# Altium schematic sheet STM32MP25XXAK Power_ascii.SchDoc: Power MPU
size A3; Date: Not used; ApprovedBy: Not used; CheckedBy: Not used; Author: Not used; CompanyName: STMicroelectronics; DrawnBy: Not used; Engineer: Not used; Organization: Not used; Address1: Not used; Address2: Not used; Address3: Not used; Address4: Not used; DocumentNumber: Not used; Revision: Not used; SheetNumber: 5; SheetTotal: 7; CurrentTime: Not used; CurrentDate: Not used; Time: Not used; DocumentFullPathAndName: Not used; DocumentName: Not used; ModifiedDate: Not used; ImagePath: Not used; ProjectName: Not used; Application_BuildNumber: Not used
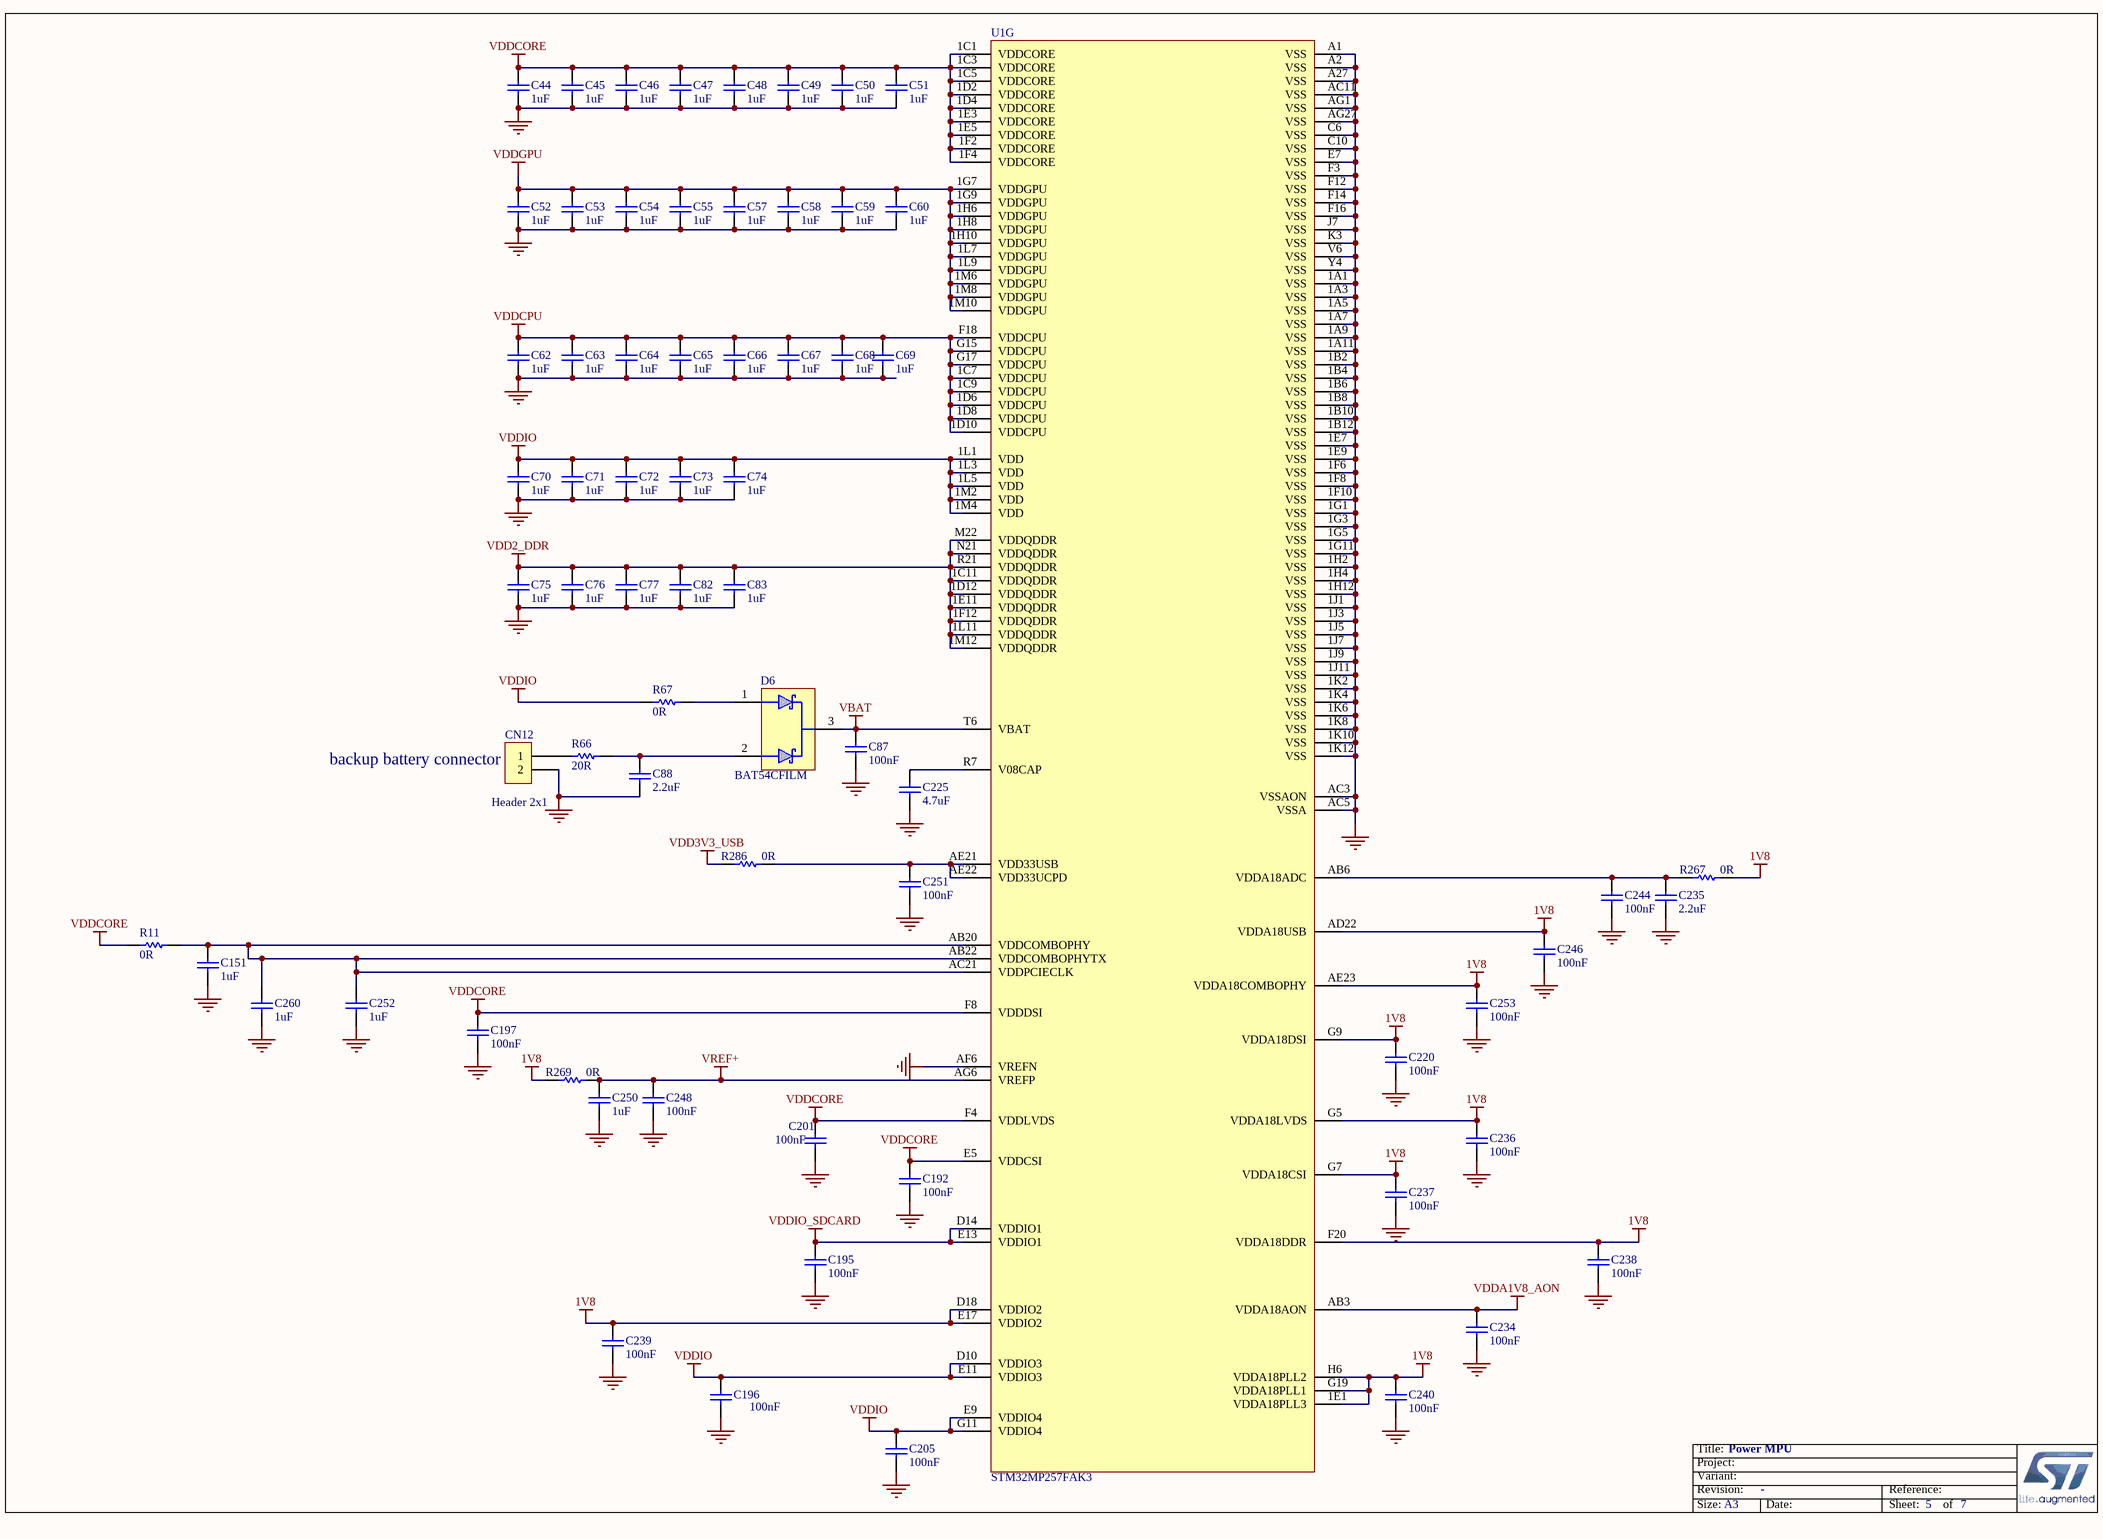
[diagram p0: STM32MP25XXAK Power_ascii.SchDoc]

## Parts
C44  1uF  [C0201_MURATA_GRM033_H0P3]
C45  1uF  [C0201_MURATA_GRM033_H0P3]
C46  1uF  [C0201_MURATA_GRM033_H0P3]
C47  1uF  [C0201_MURATA_GRM033_H0P3]
C48  1uF  [C0201_MURATA_GRM033_H0P3]
C49  1uF  [C0201_MURATA_GRM033_H0P3]
C50  1uF  [C0201_MURATA_GRM033_H0P3]
C51  1uF  [C0201_MURATA_GRM033_H0P3]
C52  1uF  [C0201_MURATA_GRM033_H0P3]
C53  1uF  [C0201_MURATA_GRM033_H0P3]
C54  1uF  [C0201_MURATA_GRM033_H0P3]
C55  1uF  [C0201_MURATA_GRM033_H0P3]
C57  1uF  [C0201_MURATA_GRM033_H0P3]
C58  1uF  [C0201_MURATA_GRM033_H0P3]
C59  1uF  [C0201_MURATA_GRM033_H0P3]
C60  1uF  [C0201_MURATA_GRM033_H0P3]
C62  1uF  [C0201_MURATA_GRM033_H0P3]
C63  1uF  [C0201_MURATA_GRM033_H0P3]
C64  1uF  [C0201_MURATA_GRM033_H0P3]
C65  1uF  [C0201_MURATA_GRM033_H0P3]
C66  1uF  [C0201_MURATA_GRM033_H0P3]
C67  1uF  [C0201_MURATA_GRM033_H0P3]
C68  1uF  [C0201_MURATA_GRM033_H0P3]
C69  1uF  [C0201_MURATA_GRM033_H0P3]
C70  1uF  [C0201_MURATA_GRM033_H0P3]
C71  1uF  [C0201_MURATA_GRM033_H0P3]
C72  1uF  [C0201_MURATA_GRM033_H0P3]
C73  1uF  [C0201_MURATA_GRM033_H0P3]
C74  1uF  [C0201_MURATA_GRM033_H0P3]
C75  1uF  [C0201_MURATA_GRM033_H0P3]
C76  1uF  [C0201_MURATA_GRM033_H0P3]
C77  1uF  [C0201_MURATA_GRM033_H0P3]
C82  1uF  [C0201_MURATA_GRM033_H0P3]
C83  1uF  [C0201_MURATA_GRM033_H0P3]
C87  value 100nF  [C0402]
C88  value 2.2uF  [C0402]  (hidden comment: Capacitor)
C151  value 1uF  [C0201_MURATA_GRM033_H0P3]  (hidden comment: Capacitor)
C192  value 100nF  [C0201_MURATA_GRM033_H0P3]  (hidden comment: Capacitor)
C195  value 100nF  [C0201_MURATA_GRM033_H0P3]  (hidden comment: Capacitor)
C196  value 100nF  [C0201_MURATA_GRM033_H0P3]  (hidden comment: Capacitor)
C197  value 100nF  [C0201_MURATA_GRM033_H0P3]  (hidden comment: Capacitor)
C201  value 100nF  [C0201_MURATA_GRM033_H0P3]  (hidden comment: Capacitor)
C205  value 100nF  [C0201_MURATA_GRM033_H0P3]  (hidden comment: Capacitor)
C220  value 100nF  [C0201_MURATA_GRM033_H0P3]  (hidden comment: Capacitor)
C225  value 4.7uF  [C0201_H0P5]  (hidden comment: Capacitor)
C234  value 100nF  [C0201_MURATA_GRM033_H0P3]  (hidden comment: Capacitor)
C235  value 2.2uF  [C0201_H0P5]  (hidden comment: Capacitor)
C236  value 100nF  [C0201_MURATA_GRM033_H0P3]  (hidden comment: Capacitor)
C237  value 100nF  [C0201_MURATA_GRM033_H0P3]  (hidden comment: Capacitor)
C238  value 100nF  [C0201_MURATA_GRM033_H0P3]  (hidden comment: Capacitor)
C239  value 100nF  [C0201_MURATA_GRM033_H0P3]  (hidden comment: Capacitor)
C240  value 100nF  [C0201_MURATA_GRM033_H0P3]  (hidden comment: Capacitor)
C244  value 100nF  [C0201_MURATA_GRM033_H0P3]  (hidden comment: Capacitor)
C246  value 100nF  [C0201_MURATA_GRM033_H0P3]  (hidden comment: Capacitor)
C248  value 100nF  [C0201_MURATA_GRM033_H0P3]  (hidden comment: Capacitor)
C250  value 1uF  [C0201_MURATA_GRM033_H0P3]  (hidden comment: Capacitor)
C251  value 100nF  [C0201_MURATA_GRM033_H0P3]  (hidden comment: Capacitor)
C252  value 1uF  [C0201_MURATA_GRM033_H0P3]  (hidden comment: Capacitor)
C253  value 100nF  [C0201_MURATA_GRM033_H0P3]  (hidden comment: Capacitor)
C260  value 1uF  [C0201_MURATA_GRM033_H0P3]  (hidden comment: Capacitor)
CN12  value Header 2x1  [CON_MOLEX_53047-0210]
D6  value BAT54CFILM  [DIO_SOT23]  (hidden comment: DIODE_3P_DUAL_COMMON_CATHODE)
R11  value 0R  [R0603]  (hidden comment: Resistor)
R66  value 20R  [R0402]  (hidden comment: Resistor)
R67  value 0R  [R0402]  (hidden comment: Resistor)
R267  value 0R  [R0402]
R269  value 0R  [R0402]
R286  value 0R  [R0402]
U1  STM32MP257FAK3  [ICC_TFBGA424_14X14_P050_H1P20_CODE-B0A2]  (part G of 9)

## Nets
1V8: C220.2 C236.2 C237.2 C238.2 C239.2 C240.2 C246.2 C253.2 R267.2 R269.1 U1.1E1(VDDA18PLL3) U1.AD22(VDDA18USB) U1.AE23(VDDA18COMBOPHY) U1.D18(VDDIO2) U1.E17(VDDIO2) U1.F20(VDDA18DDR) U1.G5(VDDA18LVDS) U1.G7(VDDA18CSI) U1.G9(VDDA18DSI) U1.G19(VDDA18PLL1) U1.H6(VDDA18PLL2)
GND: C44.2 C45.1 C46.1 C47.2 C48.1 C49.1 C50.1 C51.1 C52.1 C53.1 C54.1 C55.1 C57.1 C58.1 C59.1 C60.1 C62.2 C63.1 C64.1 C65.2 C66.1 C67.1 C68.1 C69.1 C70.2 C71.1 C72.1 C73.2 C74.1 C75.1 C76.1 C77.2 C82.1 C83.1 C87.1 C88.1 C151.1 C192.1 C195.1 C196.1 C197.1 C201.1 C205.1 C220.1 C225.1 C234.1 C235.1 C236.1 C237.1 C238.1 C239.1 C240.1 C244.1 C246.1 C248.1 C250.1 C251.1 C252.1 C253.1 C260.1 CN12.2 U1.1A1(VSS) U1.1A3(VSS) U1.1A5(VSS) U1.1A7(VSS) U1.1A9(VSS) U1.1A11(VSS) U1.1B2(VSS) U1.1B4(VSS) U1.1B6(VSS) U1.1B8(VSS) U1.1B10(VSS) U1.1B12(VSS) U1.1E7(VSS) U1.1E9(VSS) U1.1F6(VSS) U1.1F8(VSS) U1.1F10(VSS) U1.1G1(VSS) U1.1G3(VSS) U1.1G5(VSS) U1.1G11(VSS) U1.1H2(VSS) U1.1H4(VSS) U1.1H12(VSS) U1.1J1(VSS) U1.1J3(VSS) U1.1J5(VSS) U1.1J7(VSS) U1.1J9(VSS) U1.1J11(VSS) U1.1K2(VSS) U1.1K4(VSS) U1.1K6(VSS) U1.1K8(VSS) U1.1K10(VSS) U1.1K12(VSS) U1.A1(VSS) U1.A2(VSS) U1.A27(VSS) U1.AC3(VSSAON) U1.AC5(VSSA) U1.AC11(VSS) U1.AF6(VREFN) U1.AG1(VSS) U1.AG27(VSS) U1.C6(VSS) U1.C10(VSS) U1.E7(VSS) U1.F3(VSS) U1.F12(VSS) U1.F14(VSS) U1.F16(VSS) U1.J7(VSS) U1.K3(VSS) U1.V6(VSS) U1.Y4(VSS)
VBAT: C87.2 D6.3 U1.T6(VBAT)
VDD2_DDR: C75.2 C76.2 C77.1 C82.2 C83.2 U1.1C11(VDDQDDR) U1.1D12(VDDQDDR) U1.1E11(VDDQDDR) U1.1F12(VDDQDDR) U1.1L11(VDDQDDR) U1.1M12(VDDQDDR) U1.M22(VDDQDDR) U1.N21(VDDQDDR) U1.R21(VDDQDDR)
VDD3V3_USB: R286.1
VDDA1V8_AON: C234.2 U1.AB3(VDDA18AON)
VDDCORE: C44.1 C45.2 C46.2 C47.1 C48.2 C49.2 C50.2 C51.2 C192.2 C197.2 C201.2 R11.1 U1.1C1(VDDCORE) U1.1C3(VDDCORE) U1.1C5(VDDCORE) U1.1D2(VDDCORE) U1.1D4(VDDCORE) U1.1E3(VDDCORE) U1.1E5(VDDCORE) U1.1F2(VDDCORE) U1.1F4(VDDCORE) U1.E5(VDDCSI) U1.F4(VDDLVDS) U1.F8(VDDDSI)
VDDCPU: C62.1 C63.2 C64.2 C65.1 C66.2 C67.2 C68.2 C69.2 U1.1C7(VDDCPU) U1.1C9(VDDCPU) U1.1D6(VDDCPU) U1.1D8(VDDCPU) U1.1D10(VDDCPU) U1.F18(VDDCPU) U1.G15(VDDCPU) U1.G17(VDDCPU)
VDDGPU: C52.2 C53.2 C54.2 C55.2 C57.2 C58.2 C59.2 C60.2 U1.1G7(VDDGPU) U1.1G9(VDDGPU) U1.1H6(VDDGPU) U1.1H8(VDDGPU) U1.1H10(VDDGPU) U1.1L7(VDDGPU) U1.1L9(VDDGPU) U1.1M6(VDDGPU) U1.1M8(VDDGPU) U1.1M10(VDDGPU)
VDDIO: C70.1 C71.2 C72.2 C73.1 C74.2 C196.2 C205.2 R67.2 U1.1L1(VDD) U1.1L3(VDD) U1.1L5(VDD) U1.1M2(VDD) U1.1M4(VDD) U1.D10(VDDIO3) U1.E9(VDDIO4) U1.E11(VDDIO3) U1.G11(VDDIO4)
VDDIO_SDCARD: C195.2 U1.D14(VDDIO1) U1.E13(VDDIO1)
VREF+: C248.2 C250.2 R269.2 U1.AG6(VREFP)
NetC88_2: C88.2 D6.2 R66.2
NetC151_2: C151.2 C252.2 C260.2 R11.2 U1.AB20(VDDCOMBOPHY) U1.AB22(VDDCOMBOPHYTX) U1.AC21(VDDPCIECLK)
NetC225_2: C225.2 U1.R7(V08CAP)
NetC235_2: C235.2 C244.2 R267.1 U1.AB6(VDDA18ADC)
NetC251_2: C251.2 R286.2 U1.AE21(VDD33USB) U1.AE22(VDD33UCPD)
NetCN12_1: CN12.1 R66.1
NetD6_1: D6.1 R67.1

## Notes on the sheet
- (near CN12) backup battery connector
- Title:
- Project:
- Size:
- Revision:
- Variant:
- A3
- -
- Date:
- Reference:
- Sheet:
- of

## Library data of the parts
C44-C55 C57-C60 C62-C77 C82 C83 = MCD-02377: Capacitor, MLCC, 1uF, 6.3V, X5R, +/-20%, 0201, T=0,3mm; Part_Preference: Recommended; Manufacturer: MURATA; Manufacturer_Part_Number: GRM033R60J105MEA2; Order_Code_RS: 820-0643; Component_Country_Of_Origin: Japan; ShowFields: YES; ID: 4483; Status: Checked; Value: 1uF; Internal_Part_Number: MCD-02377; Part_Type: Capacitor; Package: 0201; ComponentLink1URL: http://tunmcdsvn.tun.st.com/Component_Documentation_Library/Trunk/Capacitor/MURATA_GRM_Series/GRM033R60J105MEA2/; Order_Code_Digikey: 490-7229-2-ND; Order_Code_Farnell: 2470448
C87 = MCD-00006: Capacitor,100nF,16V,X7R,10%,0402; Manufacturer_Part_Number: CC0402KRX7R7BB104; Manufacturer: YAGEO; Alternate_Manufacturer: MURATA; Alternate_Manufacturer_Part_Number: GCM155R71C104KA55D; Part_Preference: Recommended; Partial_Alternate_Internal_Part_Number: MCD-03299; Provided_By: SUBCO; Initial_Board_Reference: MB1274; Order_Code_RS: 616-9701; Component_Country_Of_Origin: China; ID: 2474; ShowFields: YES; Alternate_EMS: M; Internal_Part_Number: MCD-00006; ComponentLink1Description: Datasheet; ECCN_US: n/a; ECCN_EU: n/a; Status: Released; Part_Type: Capacitor; Package: 0402; ComponentLink1URL: http://tunmcdsvn.tun.st.com/Component_Documentation_Library/Trunk/Capacitor/YAGEO_X7R_Series; Order_Code_Digikey: 311-1338-1-ND; Order_Code_Farnell: 9402047
C88 = MCD-01823: Capacitor, MLCC, 2.2uF, 6V3, X5R,+/-10%, 0402, T=0.5mm; Part_Preference: Recommended; Manufacturer: MURATA; Manufacturer_Part_Number: GRM155R60J225KE95D; Order_Code_RS: 172-6478; Component_Country_Of_Origin: Japan; ID: 3923; ShowFields: YES; Internal_Part_Number: MCD-01823; Status: Released; Part_Type: Capacitor; Alternate_Manufacturer: N/A; Alternate_Manufacturer_Part_Number: N/A; Package: 0402; ComponentLink1URL: http://tunmcdsvn.tun.st.com/Component_Documentation_Library/Trunk/Capacitor/MURATA_GRM_Series; Order_Code_Digikey: 490-12532-1-ND; Order_Code_Farnell: 2695865
C151 C250 C252 C260 = MCD-02377: Capacitor, MLCC, 1uF, 6.3V, X5R, +/-20%, 0201, T=0,3mm; Manufacturer_Part_Number: GRM033R60J105MEA2; Manufacturer: MURATA; Part_Preference: Recommended; Order_Code_RS: 820-0643; Component_Country_Of_Origin: Japan; ID: 4483; ShowFields: YES; Status: Checked; Internal_Part_Number: MCD-02377; Part_Type: Capacitor; Alternate_Manufacturer_Part_Number: N/A; Alternate_Manufacturer: N/A; Package: 0201; ComponentLink1URL: http://tunmcdsvn.tun.st.com/Component_Documentation_Library/Trunk/Capacitor/MURATA_GRM_Series/GRM033R60J105MEA2/; Order_Code_Digikey: 490-7229-2-ND; Order_Code_Farnell: 2470448
C192 C195-C197 C201 C205 C220 C234 C236-C240 C244 C246 C248 C251 C253 = MCD-01535: Capacitor, MLCC,100nF, 10V, X7R, +/-10%, 0201, T=0.3mm; Part_Preference: Recommended; Manufacturer: MURATA; Manufacturer_Part_Number: GRM033R61A104KE15; Order_Code_RS: 790-2742; Component_Country_Of_Origin: Japan; ID: 3635; ShowFields: YES; Internal_Part_Number: MCD-01535; Status: Checked; Part_Type: Capacitor; Alternate_Manufacturer: N/A; Alternate_Manufacturer_Part_Number: N/A; Package: 0201; ComponentLink1URL: http://tunmcdsvn.tun.st.com/Component_Documentation_Library/Trunk/Capacitor/MURATA_GRM_Series; Order_Code_Digikey: 490-5881-1-ND; Order_Code_Farnell: 2470450
C225 = MCD-01534: Capacitor, MLCC, 4,7uF, 6V3, X5R, +/-20%, 0201, T=0.5mm; Part_Preference: Recommended; Manufacturer: MURATA; Manufacturer_Part_Number: GRM035R60J475ME15; Component_Country_Of_Origin: Japan; ID: 3634; ShowFields: YES; Internal_Part_Number: MCD-01534; Status: Checked; Part_Type: Capacitor; Alternate_Manufacturer: N/A; Alternate_Manufacturer_Part_Number: N/A; Package: 0201; ComponentLink1URL: http://tunmcdsvn.tun.st.com/Component_Documentation_Library/Trunk/Capacitor/MURATA_GRM_Series; Order_Code_Digikey: 490-13230-1-ND; Order_Code_Farnell: N/A; Order_Code_RS: N/A
C235 = MCD-02235: Capacitor, MLCC, 2.2uF, 10V, X5R,+/-10%, 0201, T=0.5mm; Part_Preference: Recommended; Manufacturer: MURATA; Manufacturer_Part_Number: GRM033R61A225KE47D; Order_Code_RS: NA; Component_Country_Of_Origin: Japan; ShowFields: YES; ID: 4335; Internal_Part_Number: MCD-02235; Status: Checked; Part_Type: Capacitor; Package: 0201; ComponentLink1URL: http://tunmcdsvn.tun.st.com/Component_Documentation_Library/Trunk/Capacitor/MURATA_GRM_Series; Order_Code_Digikey: 490-13227-1-ND; Order_Code_Farnell: NA
CN12 = MCD-00655: Header 2 circuits, 1.25mm Pitch ,  Vertical, with Friction Lock; Part_Type: Connector; Manufacturer_Part_Number: 53047-0210; Manufacturer: MOLEX; BMS_Part_Number: 9083002; Part_Preference: Recommended; Provided_By: SUBCO; Initial_Board_Reference: MB1272; Order_Code_RS: 279-9213; Component_Country_Of_Origin: Unknown; ID: 3091; ShowFields: YES; Internal_Part_Number: MCD-00655; Status: Released; ComponentLink1Description: Datasheet; ComponentLink1URL: http://tunmcdsvn.tun.st.com/Component_Documentation_Library/Trunk/Connector/MOLEX_53047-0210/; ECCN_US: n/a; ECCN_EU: n/a; Alternate_Manufacturer: N/A; Alternate_Manufacturer_Part_Number: N/A; Order_Code_Digikey: WM1731-ND; Order_Code_Farnell: 9733051
D6 = MCD-03280: Diode, Schottky, Dual Common Cathode, 0V3, 300mA, 40V, SOT-23; Part_Preference: Recommended; Manufacturer: STMICROELECTRONICS; Full_Alternate_Internal_Part_Number: BAT54C+, BAT54CLT1G, BAT54C-7-F, BAT54C,215; Order_code_RS: 795-8397; Component_Country_Of_Origin: China; ShowFields: YES; ID: 5396; Order_code_Digikey: N/A; Order_code_Farnell: 9801499; Status: New; ComponentLink1URL: http://tunmcdsvn.tun.st.com/Component_Documentation_Library/Trunk/Diode/STMICROELECTRONICS_BAT54_Series; Internal_Part_Number: MCD-03280; Part_Type: Diode; Manufacturer_Part_Number: BAT54CFILM; Package: SOT-23
R11 = MCD-00056: Resistor, 0R, 0603, +/-5%, 1/10W; Part_Preference: Recommended; Manufacturer: YAGEO; Manufacturer_Part_Number: RC0603JR-070RL; Component_Country_Of_Origin: China; ShowFields: YES; ID: 2536; Internal_Part_Number: MCD-00056; Status: Released; Part_Type: Resistor; Package: 0603; ComponentLink1URL: http://tunmcdsvn.tun.st.com/Component_Documentation_Library/Trunk/Resistor/YAGEO_RC_L_Series; Order_Code_Digikey: 311-0.0GRCT-ND; Order_Code_Farnell: 9233130RL; Order_Code_RS: N/A
R66 = MCD-00058: Resistor, 20R, 0402, +/-1%, 1/16W; BMS_Part_Number: 9131027; Part_Preference: Recommended; Manufacturer: YAGEO; Manufacturer_Part_Number: RC0402FR-0720RL; Component_Country_Of_Origin: China; ID: 2537; ShowFields: YES; Internal_Part_Number: MCD-00058; Status: Released; Part_Type: Resistor; Alternate_Manufacturer: N/A; Alternate_Manufacturer_Part_Number: N/A; Package: 0402; ComponentLink1URL: http://tunmcdsvn.tun.st.com/Component_Documentation_Library/Trunk/Resistor/YAGEO_RC_L_Series; Order_Code_Digikey: 311-20LRCT-ND; Order_Code_Farnell: 1799192; Order_Code_RS: N/A
R67 = MCD-00052: Resistor, 0R, 0402, +/-5%, 1/16W; Manufacturer_Part_Number: RC0402JR-070RL; Manufacturer: YAGEO; Part_Preference: Recommended; Order_Code_RS: 618-5804; Component_Country_Of_Origin: China; ShowFields: YES; ID: 2540; Internal_Part_Number: MCD-00052; Status: Released; Part_Type: Resistor; ComponentLink1URL: http://tunmcdsvn.tun.st.com/Component_Documentation_Library/Trunk/Resistor/YAGEO_RC_L_Series; Package: 0402; Order_Code_Digikey: 311-0.0JRCT-ND; Order_Code_Farnell: 9232516RL
R267 R269 R286 = MCD-00052: Resistor,0R,0402,5%,1/16W; Manufacturer_Part_Number: RC0402JR-070RL; Manufacturer: YAGEO; Part_Preference: Recommended; ECCN_US: EAR99; ECCN_EU: NEC; Provided_By: SUBCO; Initial_Board_Reference: mb1274; Order_Code_RS: 618-5804; Component_Country_Of_Origin: China; ID: 2540; ShowFields: YES; Internal_Part_Number: MCD-00052; ComponentLink1Description: Datasheet; Status: Released; Part_Type: Resistor; ComponentLink1URL: http://tunmcdsvn.tun.st.com/Component_Documentation_Library/Trunk/Resistor/YAGEO_RC_L_Series; Package: 0402; Alternate_Manufacturer: N/A; Alternate_Manufacturer_Part_Number: N/A; Order_Code_Digikey: 311-0.0JRCT-ND; Order_Code_Farnell: 9232516RL
U1 = MCD-03375: MPU , 2xCortex-A35@1.5GHz, Cortex-M33@400MHz, TFBGA 14x14, pitch 0.5, 808 KB SRAM, With Crypto; Part_Type: IC; Part_Preference: Recommended; Manufacturer: STMICROELECTRONICS; Component_Country_Of_Origin: Unknown; ShowFields: YES; ID: 5491; Internal_Part_Number: MCD-03375; Value: STM32MP257FAK3; Status: Checked; Manufacturer_Part_Number: STM32MP257FAK3; Package: TFBGA; ComponentLink1URL: http://tunmcdsvn.tun.st.com/Component_Documentation_Library/Trunk/IC/STMICROELECTRONICS_STM32MP257FAK3; Order_Code_Digikey: N/A; Order_Code_Farnell: N/A; Order_Code_RS: N/A